# Altium project Fonte 12V-2A.PrjPcb
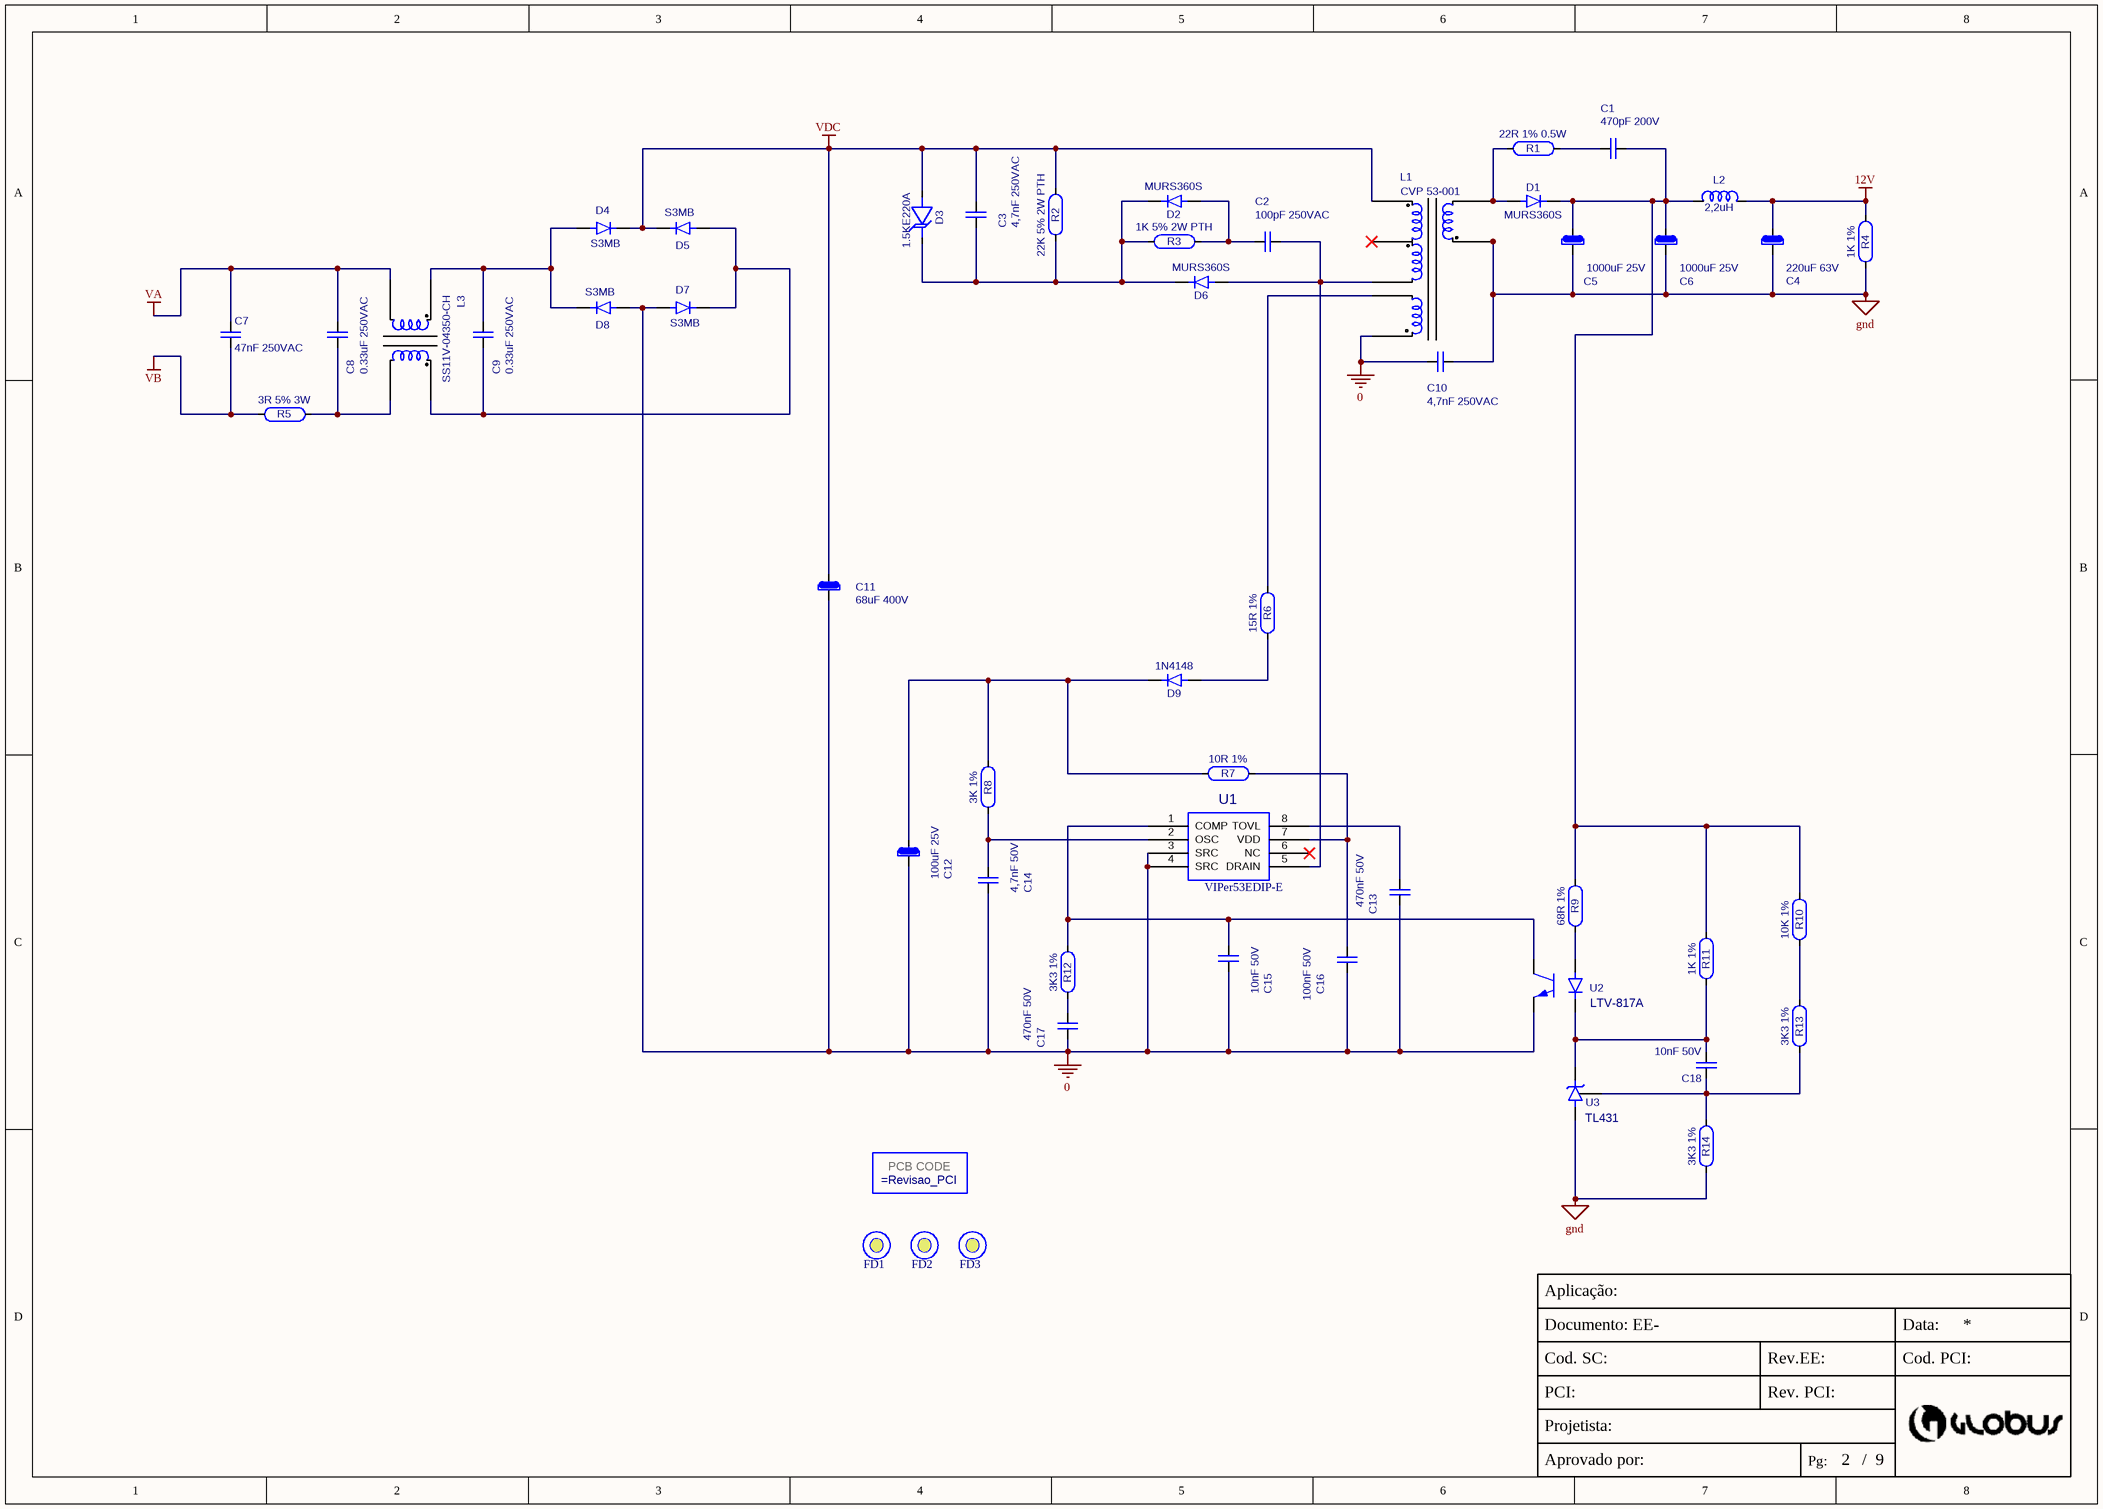
[diagram p0: Fonte 12V-2A.SchDoc]
1 sheet, 51 parts. Net scope: global (net labels, ports and power ports of the same name join across sheets).
Board files: Fonte 12V-2A.PcbDoc, Fonte 12V-2A - Panel.PcbDoc

## Sheet Fonte 12V-2A.SchDoc
size A3; SheetNumber: 2; SheetTotal: 9

### Parts
=Revisao_PCI  *  [NULL_FOOTPRINT]  (value not drawn)
C1  470pF 200V  [C0603]
C2  100pF 250VAC  [CAP_DE]
C3  value 4,7nF 250VAC  [WYO]  (hidden comment: 4,7nF 250VAC Y2)
C4  220uF 63V  [CAP200P_D10H20]
C5  1000uF 25V  [CAP5_D12.5H25]
C6  1000uF 25V  [CAP5_D12.5H25]
C7  47nF 250VAC  [CAP_R75_H11mm_L13mm]
C8  0.33uF 250VAC  [R75]
C9  0.33uF 250VAC  [R75]
C10  value 4,7nF 250VAC  [WYO]  (hidden comment: 4,7nF 250VAC Y2)
C11  68uF 400V  [CAP5_D12.5H31.5]
C12  100uF 25V  [CAP100P_D6.3H11]
C13  470nF 50V  [C0805]
C14  4,7nF 50V  [C0805]
C15  10nF 50V  [C0805]
C16  100nF 50V  [C0805]
C17  470nF 50V  [C0805]
C18  10nF 50V  [C0805]
D1  MURS360S  [DO214AA-SMB]
D2  MURS360S  [DO214AA-SMB]
D3  1.5KE220A  [1.5KE]
D4  S3MB  [DO214AA-SMB]
D5  S3MB  [DO214AA-SMB]
D6  MURS360S  [DO214AA-SMB]
D7  S3MB  [DO214AA-SMB]
D8  S3MB  [DO214AA-SMB]
D9  1N4148  [SOD80-MINIMELF]
FD1  Fiducial  [Fiducial]  (value not drawn)
FD2  Fiducial  [Fiducial]  (value not drawn)
FD3  Fiducial  [Fiducial]  (value not drawn)
L1  CVP 53-001  [CVP 53-001]
L2  2,2uH  [l2512]
L3  SS11V-04350-CH  [SS11V-04350-CH]
R1  value 22R 1% 0.5W  [R0805]  (hidden comment: 22R 1%)
R2  value 22K 5% 2W PTH  [RES2W_L16mm_D5.5]  (hidden comment: 22K 5% 2W)
R3  value 1K 5% 2W PTH  [RES2W_L16mm_D5.5]  (hidden comment: 1K 5% 2W)
R4  1K 1%  [R1206]
R5  3R 5% 3W  [RES2W_L16mm_D5.5]
R6  15R 1%  [R1206]
R7  10R 1%  [R0805]
R8  3K 1%  [R0805]
R9  68R 1%  [R1206]
R10  10K 1%  [R0805]
R11  1K 1%  [R1206]
R12  3K3 1%  [R0805]
R13  3K3 1%  [R0805]
R14  3K3 1%  [R0805]
U1  VIPer53EDIP-E  [DIP8]
U2  LTV-817A  [DIP4]
U3  TL431  [SOT23]

### Nets
0: C10.1 C11.1(negative) C12.1(negative) C13.1 C14.2 C15.1 C16.1 C17.1 D7.1(anode) D8.1(anode) L1.2 U1.3(SRC) U1.4(SRC) U2.3(E)
12V: C4.2(positive) L2.2 R4.2
gnd: C4.1(negative) C5.1(negative) C6.1(negative) C10.2 L1.6 L1.7 L1.8 R4.1 R14.1 U3.2(A)
VA: C7.1 C8.1 L3.4
VB: C7.2 R5.1
VDC: C3.2 C11.2(positive) D3.1(anode) D4.2(cathode) D5.2(cathode) L1.5 R2.2
NetC1_1: C1.1 R1.2
NetC1_2: C1.2 C5.2(positive) C6.2(positive) D1.2(K) L2.1 R9.2 R10.2 R11.2
NetC2_1: C2.1 D2.1(A) R3.2
NetC2_2: C2.2 D6.1(A) L1.3 U1.5(DRAIN)
NetC3_1: C3.1 D2.2(K) D3.2(cathode) D6.2(K) R2.1 R3.1
NetC8_2: C8.2 L3.3 R5.2
NetC9_1: C9.1 D4.1(anode) D8.2(cathode) L3.2
NetC9_2: C9.2 D5.1(anode) D7.2(cathode) L3.1
NetC12_2: C12.2(positive) D9.2(cathode) R7.1 R8.2
NetC13_2: C13.2 U1.8(TOVL)
NetC14_1: C14.1 R8.1 U1.2(OSC)
NetC15_2: C15.2 R12.2 U1.1(COMP) U2.4(C)
NetC16_2: C16.2 R7.2 U1.7(VDD)
NetC17_2: C17.2 R12.1
NetC18_1: C18.1 R13.1 R14.2 U3.3(F)
NetC18_2: C18.2 R11.1 U2.2(K) U3.1(K)
NetD1_1: D1.1(A) L1.9 L1.10 L1.11 R1.1
NetD9_1: D9.1(anode) R6.1
NetL1_1: L1.1 R6.2
NetR9_1: R9.1 U2.1(A)
NetR10_1: R10.1 R13.2

Not connected (* = marked no-connect by the designer): L1 4*; U1 6(NC)*

### Notes on the sheet
- Aplicação:
- Cod. SC:
- PCI:
- Documento: EE-
- Rev. PCI:
- Rev.EE:
- Data:
- Cod. PCI:
- Projetista:
- Aprovado por:
- Pg:
- /
- (in symbol CODIGO PCI) PCB CODE

### Library data of the parts
=Revisao_PCI = CODIGO PCI: Preencher com o código da placa. Irá aparecer na serigrafia.; REFERENCIA: =Revisao_PCI; ENCAPSULAMENTO: *; ModifyDate: 16/08/2016 11:46:26; Value: *
C1 = CC 470pF 200V 0603: Part Number: 06032C471KAT2A; REFERENCIA: ???; ENCAPSULAMENTO: C0603; ModifyDate: ???; Value: 470pF 200V
C2 = CC 100pF 250VAC: Part Number: DE1B3KX101KA4BN01F; REFERENCIA: ???; ENCAPSULAMENTO: DE; ModifyDate: ???; Value: 100pF 250VAC
C3 C10 = CC 4,7nF 250VAC Y2: Part Number: WYO472MCMCF0KR; REFERENCIA: ???; ENCAPSULAMENTO: WYO; ModifyDate: ???
C4 = CE 220uF 63V PTH: C.Elet.220uF 63V 20% Radial; Part Number: *; REFERENCIA: 003.50.019; ENCAPSULAMENTO: CAP200P_D10H20; ModifyDate: 05/27/2015 14:07:26; Value: 220uF 63V
C5 C6 = CE 1000uF 25V PTH: C.Elet.1000uF 25V 20% Radial; Part Number: REA102M1EBK-1320P; ENCAPSULAMENTO: PTH; REFERENCIA: ?; ModifyDate: ?; Value: 1000uF 25V
C7 = CC 47nF 250VAC: Part Number: R75LF24704000K; REFERENCIA: ???; ENCAPSULAMENTO: R75; ModifyDate: ???; Value: 47nF 250VAC
C8 C9 = CC 0.33uF 250VAC: Part Number: ECQ-U2A334KL; REFERENCIA: ???; ENCAPSULAMENTO: R75; ModifyDate: ???; Value: 0.33uF 250VAC
C11 = CE 68uF 400V PTH: C.Elet.68uF 400V 20% Radial; Part Number: UPZ2G680MHD; ENCAPSULAMENTO: PTH; REFERENCIA: ?; ModifyDate: ?; Value: 68uF 400V
C12 = CE 100uF 25V PTH: C.Elet.1000uF 25V 20% Radial; ENCAPSULAMENTO: PTH; Part Number: *; REFERENCIA: 003.50.001; ModifyDate: 05/27/2015 14:07:26; Value: 100uF 25V
C13 C17 = CC 470nF 50V 0805: REFERENCIA: ???; ENCAPSULAMENTO: C0805; ModifyDate: ???; Value: 470nF 50V
C14 = CC 4,7nF 50V 0805: REFERENCIA: ???; ENCAPSULAMENTO: C0805; ModifyDate: ???; Value: 4,7nF 50V
C15 C18 = CC 10nF 50V 0805: REFERENCIA: 003.05.003; ENCAPSULAMENTO: C0805; ModifyDate: 05/27/2015 14:07:26; Value: 10nF 50V
C16 = CC 100nF 50V 0805: REFERENCIA: 003.05.002; ENCAPSULAMENTO: C0805; ModifyDate: 05/27/2015 14:07:26; Value: 100nF 50V
D1 D2 D6 = D MURS360S SMB: Dio.Ultra Fast Rectifier SMT 600V 3A SMC MURS360S; ENCAPSULAMENTO: D0214AA_SMB; Part Number: *; REFERENCIA: 005.00.003; Value: MURS360S
D3 = D 1.5KE220A 1.5KE: Part Number: {Part Number}; REFERENCIA: ???; ENCAPSULAMENTO: 1.5KE; Value: 1.5KE220A
D4 D5 D7 D8 = D S3MB DO214AA: Part Number: {Part Number}; REFERENCIA: ???; ENCAPSULAMENTO: D0214AA; Value: S3MB
D9 = D 1N4148 SMD: Diodo 1N4148 (LL4148) MINI MELF/SOD80; REFERENCIA: 005.03.001; ENCAPSULAMENTO: MINIMELF; ModifyDate: 05/27/2015 14:07:26; Value: 1N4148
L1 = IND CVP 53-001: REFERENCIA: ???; ENCAPSULAMENTO: *; ModifyDate: ???; Value: CVP 53-001
L2 = IND 2,2uH 2512 SMD: Part Number: SRN2512-2R2M; REFERENCIA: ???; ENCAPSULAMENTO: SMD; ModifyDate: ???; Value: 2,2uH
L3 = IND SS11V-04350-CH CHOKE PTH: REFERENCIA: ???; ENCAPSULAMENTO: *; ModifyDate: ???; Part Number: SS11V-04350-CH; Value: SS11V-04350-CH
R1 = RES 22R 1% 0805 0.5W: Part Number: ERJ-P06F22R0V; REFERENCIA: ???; ENCAPSULAMENTO: R0805; ModifyDate: ???
R2 = RES 22K 5% 2W PTH: Part Number: ON2235E-R58; REFERENCIA: ???; ENCAPSULAMENTO: RES PTH; ModifyDate: ???
R3 = RES 1K 5% 2W PTH: Part Number: ON1025E-R58; REFERENCIA: ???; ENCAPSULAMENTO: RES PTH; ModifyDate: ???
R4 R11 = RES 1K 1% 1206: Part Number: {Part Number}; REFERENCIA: 002.10.010; ENCAPSULAMENTO: R1206; ModifyDate: 05/27/2015 14:07:26; Value: 1K 1%
R5 = RES 3R 5% 3W PTH: Part Number: PR03000203008JAC00; REFERENCIA: ???; ENCAPSULAMENTO: RES PTH; ModifyDate: ???; Value: 3R 5% 3W
R6 = RES 15R 1% 1206: Part Number: {Part Number}; REFERENCIA: ???; ENCAPSULAMENTO: R1206; ModifyDate: ???; Value: 15R 1%
R7 = RES 10R 1% 0805: Part Number: {Part Number}; REFERENCIA: 002.05.005; ENCAPSULAMENTO: R0805; ModifyDate: 05/27/2015 14:07:26; Value: 10R 1%
R8 = RES 3K 1% 0805: Part Number: {Part Number}; REFERENCIA: ???; ENCAPSULAMENTO: R0805; ModifyDate: ???; Value: 3K 1%
R9 = RES 68R1% 1206: RES 68R 1% 1206; Part Number: {Part Number}; REFERENCIA: ???; ENCAPSULAMENTO: R1206; ModifyDate: ???; Value: 68R 1%
R10 = RES 10K 1% 0805: Part Number: {Part Number}; REFERENCIA: 002.05.004; ENCAPSULAMENTO: R0805; ModifyDate: 05/27/2015 14:07:26; Value: 10K 1%
R12-R14 = RES 3K3 1% 0805: Part Number: {Part Number}; REFERENCIA: 002.05.021; ENCAPSULAMENTO: R0805; ModifyDate: 05/27/2015 14:07:26; Value: 3K3 1%
U1 = CI VIPer53E DIP-8: Part Number: {Part Number}; REFERENCIA: -; ENCAPSULAMENTO: DIP-8; ModifyDate: -; Value: VIPer53EDIP-E
U2 = CI LTV-817A DIP4: REFERENCIA: ???; ENCAPSULAMENTO: DIP4; ModifyDate: ???; Part Number: LTV-817A; Value: LTV-817A
U3 = CI TL431 SOT23: Part Number: TL431AIL3T; REFERENCIA: ???; ENCAPSULAMENTO: SOT23; ModifyDate: ???; Value: TL431